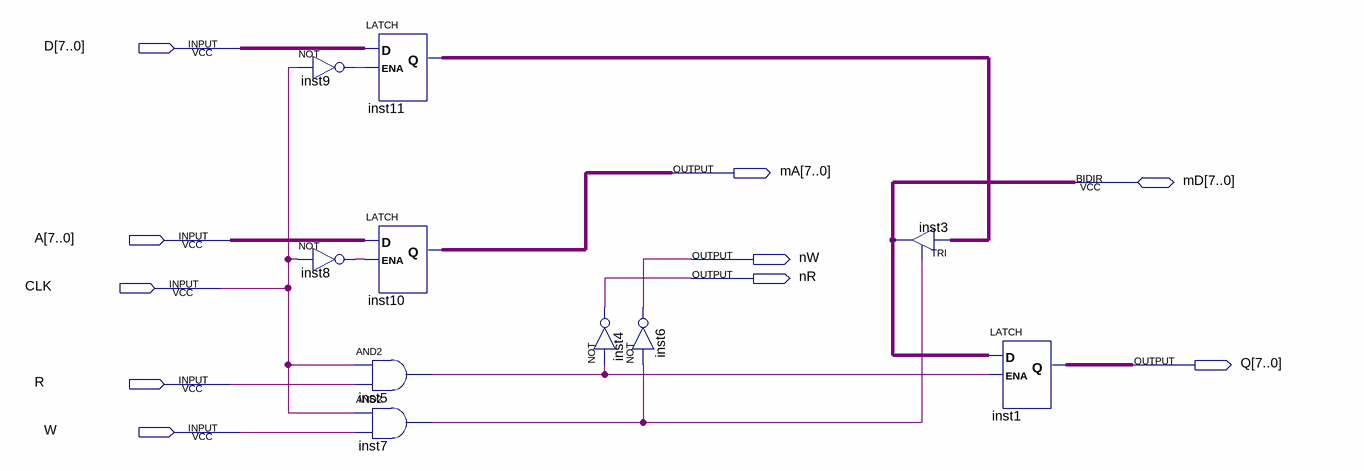
[diagram p0: schematic sheet]
// Quartus schematic memctrl.bdf as structural Verilog: 10 symbols, 10 pins
module memctrl (
  input  [7:0] D,
  input  [7:0] A,
  input  CLK,
  input  R,
  input  W,
  inout  [7:0] mD,
  output [7:0] mA,
  output nW,
  output nR,
  output [7:0] Q
);

  wire inst5_out, inst7_out, inst8_out, inst9_out;
  wire [7:0] inst11_q;

  not inst9 (inst9_out, CLK);
  not inst8 (inst8_out, CLK);
  LATCH inst11[7:0] (.D(D), .ENA(inst9_out), .Q(inst11_q));
  LATCH inst10[7:0] (.D(A), .ENA(inst8_out), .Q(mA));
  and inst5 (inst5_out, CLK, R);
  and inst7 (inst7_out, CLK, W);
  not inst4 (nR, inst5_out);
  not inst6 (nW, inst7_out);
  TRI inst3[7:0] (.IN(inst11_q), .OE(inst7_out), .OUT(mD));
  LATCH inst1[7:0] (.D(mD), .ENA(inst5_out), .Q(Q));
endmodule
